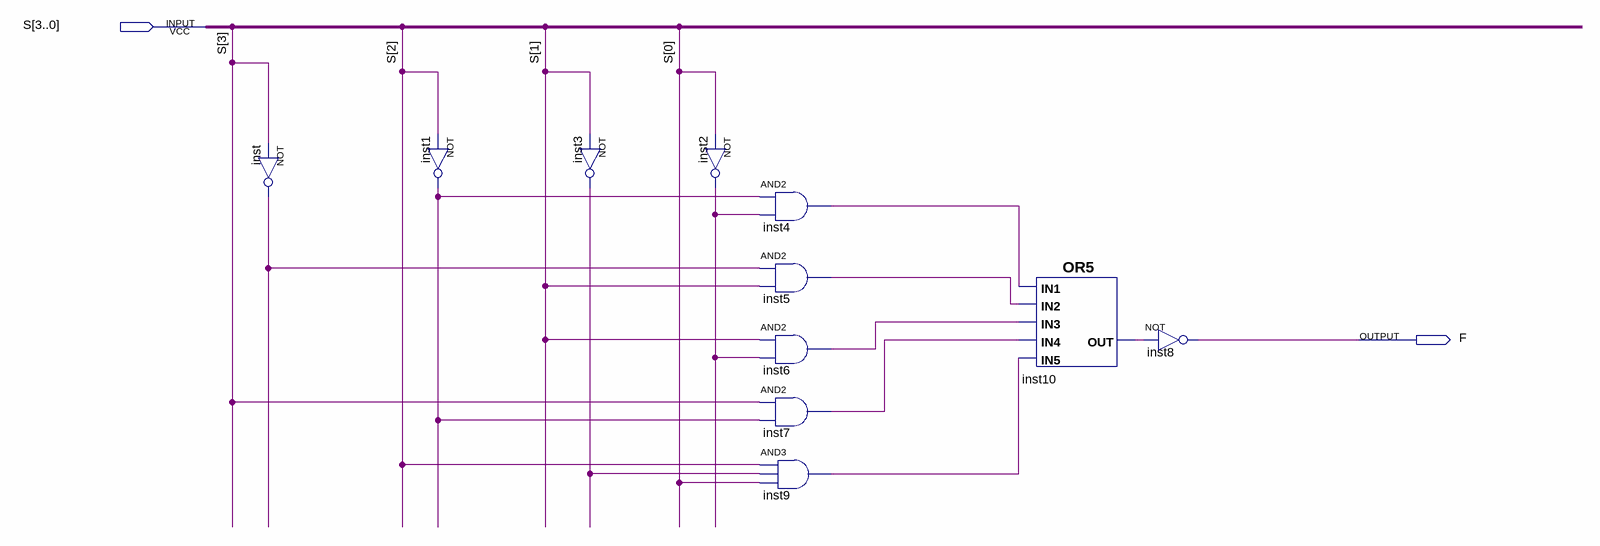
[diagram p0: schematic sheet]
// Quartus schematic DisplayF.bdf as structural Verilog: 11 symbols, 2 pins
module DisplayF (
  input  [3:0] S,
  output F
);

  wire inst1_out, inst2_out, inst3_out, inst4_out, inst5_out, inst6_out, inst7_out, inst9_out, inst10_out,
       inst_out;

  not inst (inst_out, S[3]);
  not inst1 (inst1_out, S[2]);
  not inst3 (inst3_out, S[1]);
  not inst2 (inst2_out, S[0]);
  and inst4 (inst4_out, inst1_out, inst2_out);
  and inst5 (inst5_out, inst_out, S[1]);
  and inst6 (inst6_out, S[1], inst2_out);
  and inst7 (inst7_out, S[3], inst1_out);
  and inst9 (inst9_out, S[2], inst3_out, S[0]);
  or inst10 (inst10_out, inst4_out, inst5_out, inst6_out, inst7_out, inst9_out);
  not inst8 (F, inst10_out);
endmodule
